# Altium project Mother_board_bna.PrjPcb
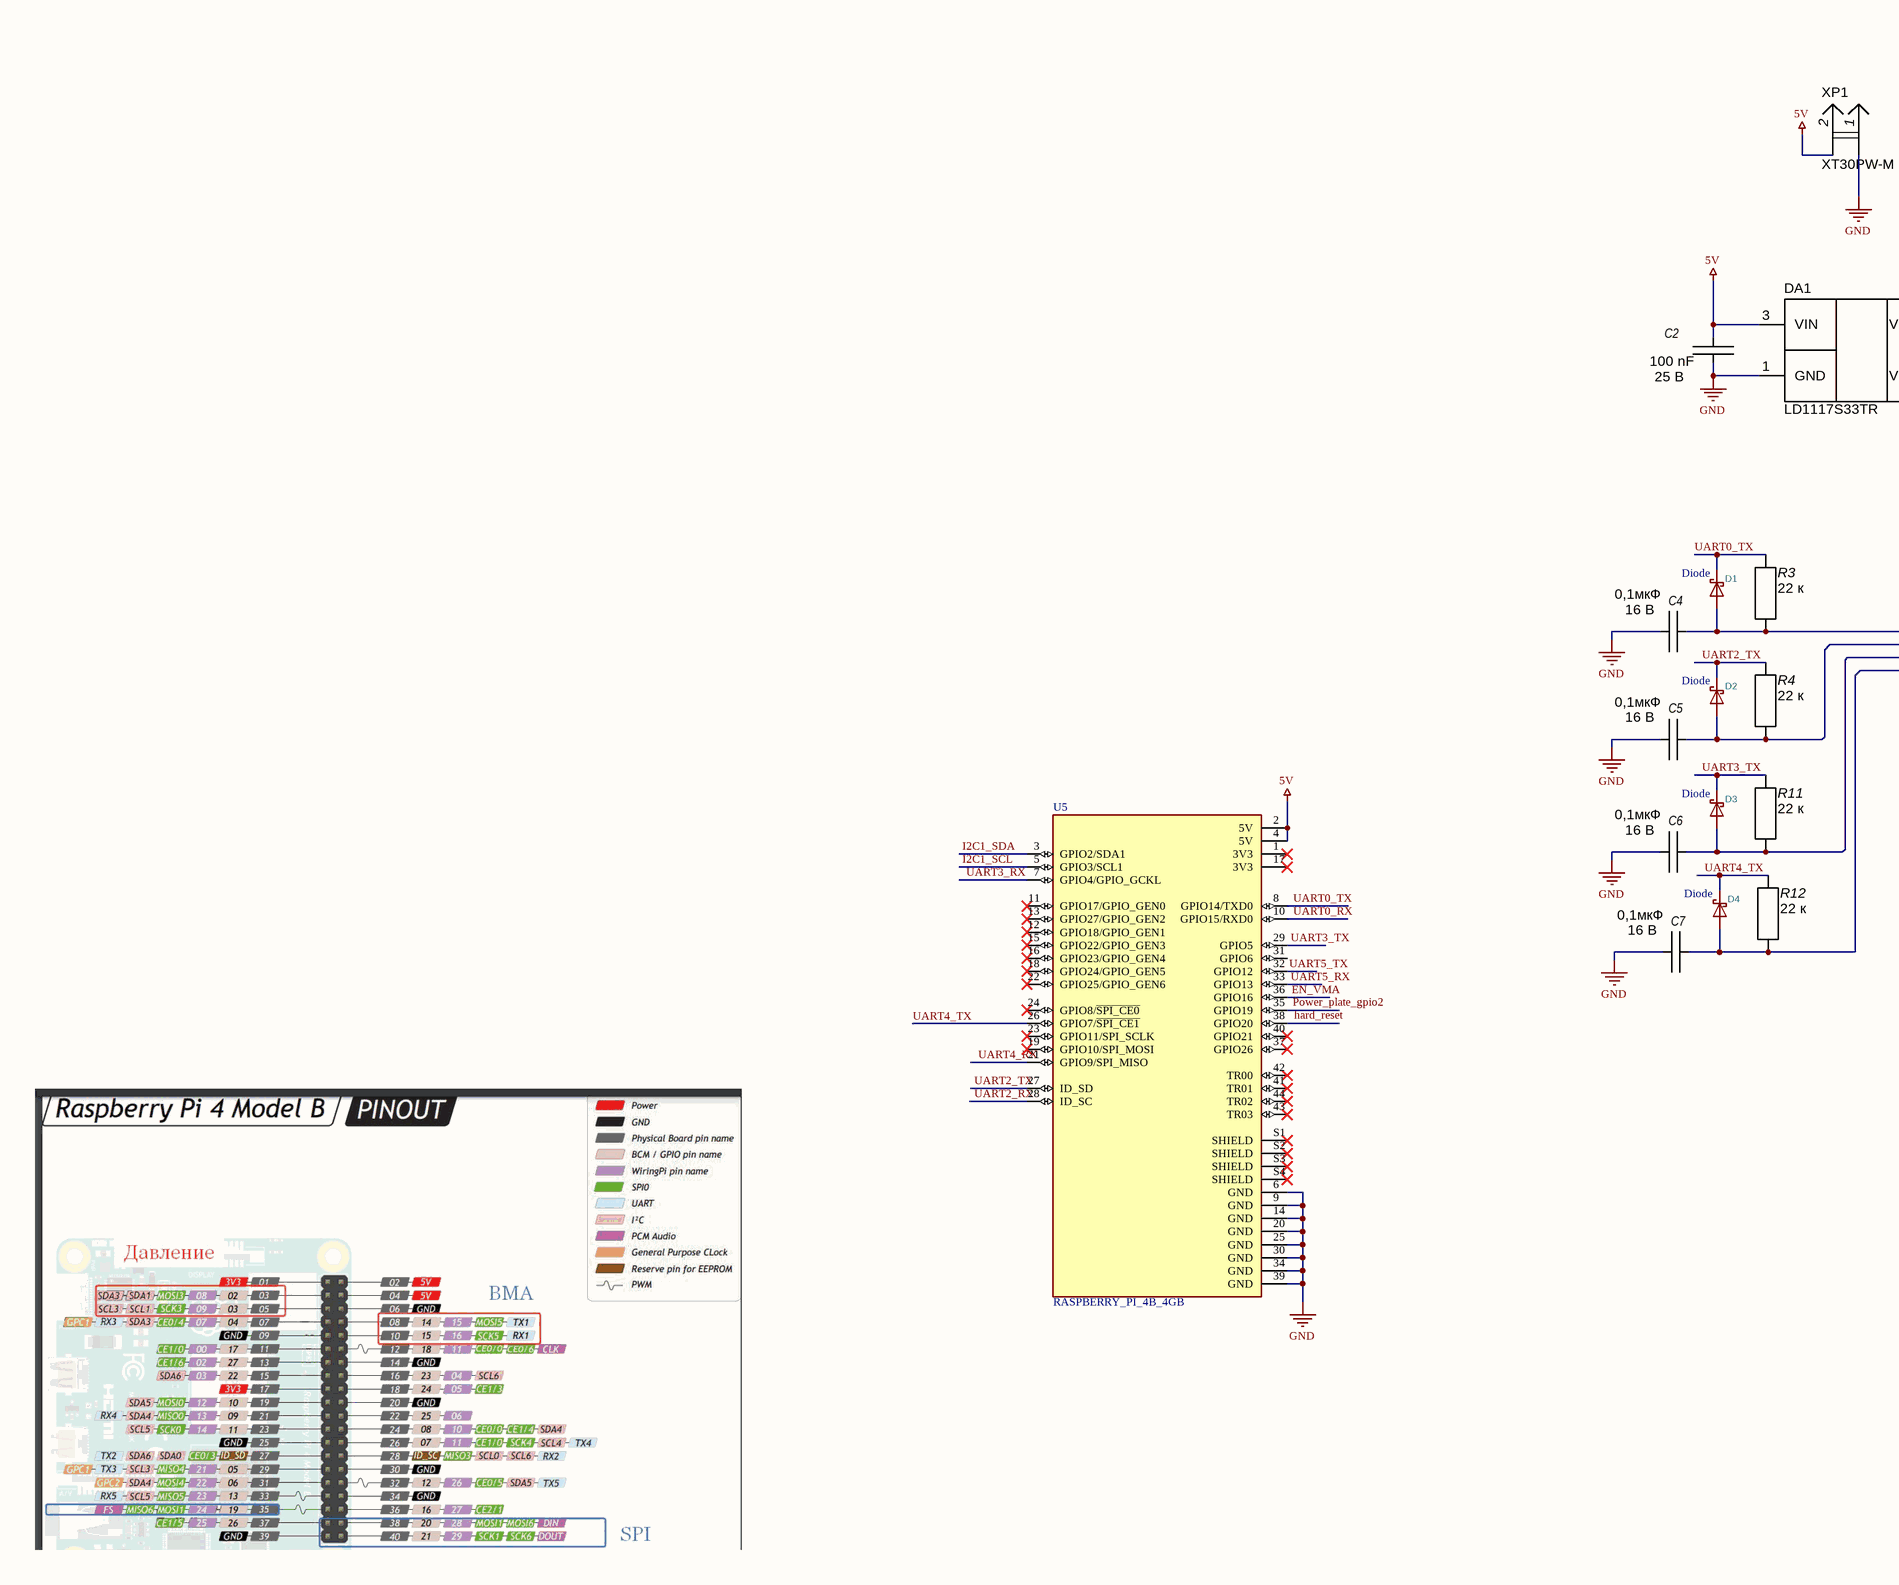
[diagram p0: Main.SchDoc, left]
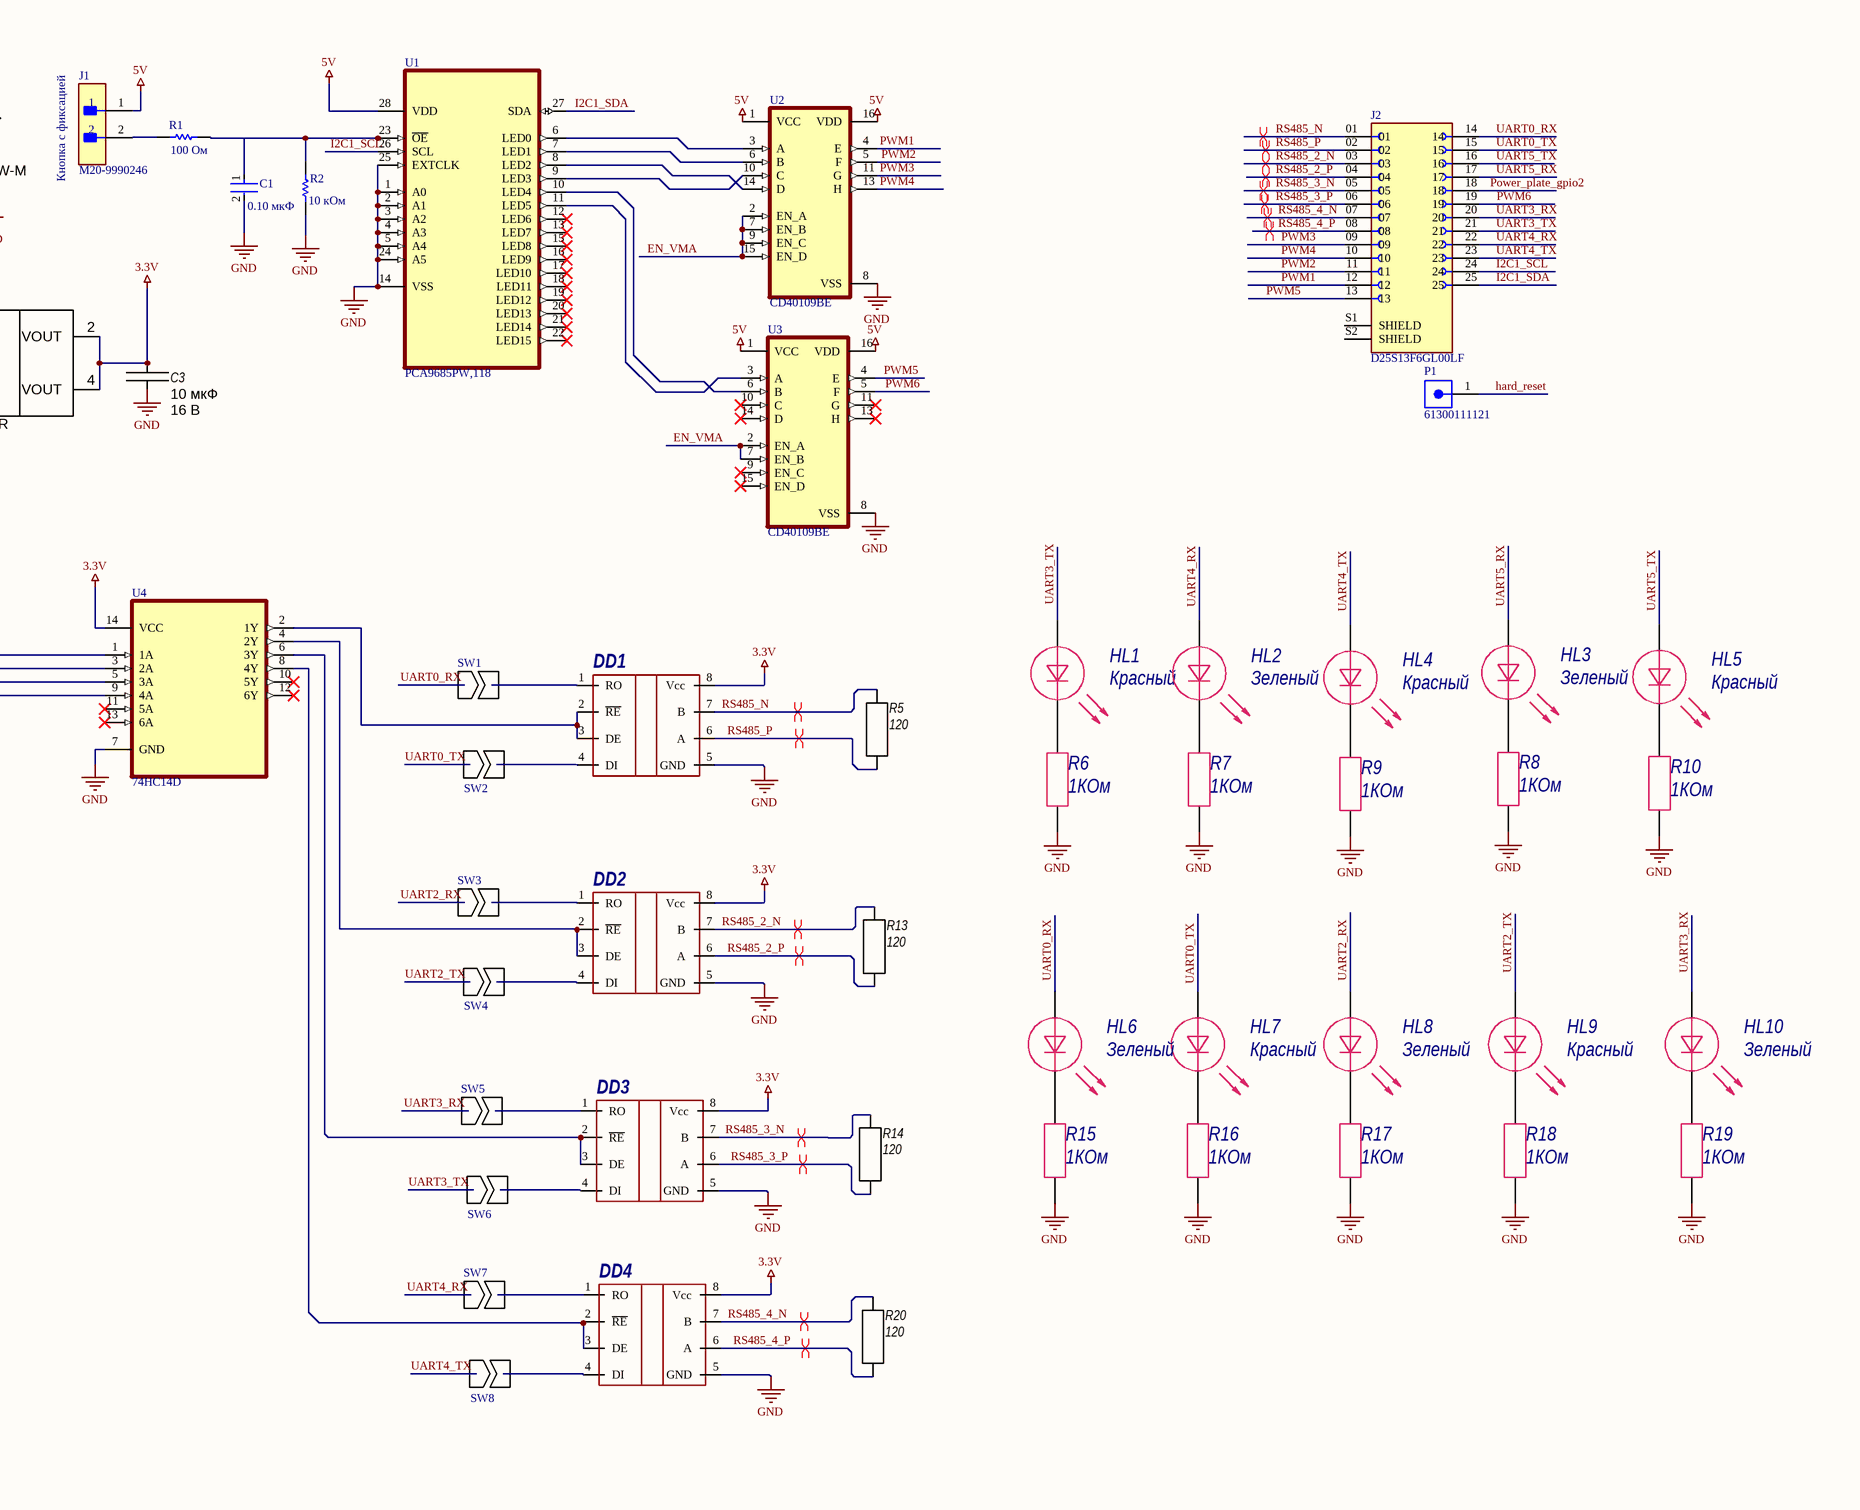
[diagram p1: Main.SchDoc, right]
1 sheet, 63 parts. Net scope: global (net labels, ports and power ports of the same name join across sheets).
Board file: PCB1.PcbDoc

## Sheet Main.SchDoc
size A2; SheetNumber: 2; SheetTotal: 2

### Parts
C1  value 0.10 мкФ  [FP-C0805C-DN-IPC_A]  (hidden comment: C0805C104K5RACTU)
C2  Voltage: 25 В  [C0402C]  (hidden comment: 100 nF)
C3  Voltage: 16 В  [C0805C]  (hidden comment: 10 мкФ)
C4  Voltage: 16 В  [C0603C]  (hidden comment: 0,1мкФ)
C5  Voltage: 16 В  [C0603C]  (hidden comment: 0,1мкФ)
C6  Voltage: 16 В  [C0603C]  (hidden comment: 0,1мкФ)
C7  Voltage: 16 В  [C0603C]  (hidden comment: 0,1мкФ)
D1  Diode  [SOD-123F]
D2  Diode  [SOD-123F]
D3  Diode  [SOD-123F]
D4  Diode  [SOD-123F]
DA1  LD1117S33TR  [SOT-223]
DD1  (no value)  [SOIC8N]
DD2  (no value)  [SOIC8N]
DD3  (no value)  [SOIC8N]
DD4  (no value)  [SOIC8N]
HL1  Color: Красный  [0805D]
HL2  Color: Зеленый  [0805D]
HL3  Color: Зеленый  [0805D]
HL4  Color: Красный  [0805D]
HL5  Color: Красный  [0805D]
HL6  Color: Зеленый  [0805D]
HL7  Color: Красный  [0805D]
HL8  Color: Зеленый  [0805D]
HL9  Color: Красный  [0805D]
HL10  Color: Зеленый  [0805D]
J1  M20-9990246  [FP-M20-9990246-MFG]
J2  D25S13F6GL00LF  [AMPHENOL_D25S13F6GL00LF]
P1  61300111121  [61300111121]
R1  value 100 Ом  [RESC2013X70X40ML20T20]  (hidden comment: ERJ-6ENF1001V)
R2  value 10 кОм  [RESC2013X70X40ML20T20]  (hidden comment: ERJ-6ENF1001V)
R3  22 к  [C0603R]
R4  22 к  [C0603R]
R5  120  [C0603R]
R6  value 1КОм  [0603R]  (hidden comment: Resistor)
R7  value 1КОм  [0603R]  (hidden comment: Resistor)
R8  value 1КОм  [0603R]  (hidden comment: Resistor)
R9  value 1КОм  [0603R]  (hidden comment: Resistor)
R10  value 1КОм  [0603R]  (hidden comment: Resistor)
R11  22 к  [C0603R]
R12  22 к  [C0603R]
R13  120  [C0603R]
R14  120  [C0603R]
R15  value 1КОм  [0603R]  (hidden comment: Resistor)
R16  value 1КОм  [0603R]  (hidden comment: Resistor)
R17  value 1КОм  [0603R]  (hidden comment: Resistor)
R18  value 1КОм  [0603R]  (hidden comment: Resistor)
R19  value 1КОм  [0603R]  (hidden comment: Resistor)
R20  120  [C0603R]
SW1  SW2  [SW2]  (value not drawn)
SW2  SW2  [SW2]  (value not drawn)
SW3  SW2  [SW2]  (value not drawn)
SW4  SW2  [SW2]  (value not drawn)
SW5  SW2  [SW2]  (value not drawn)
SW6  SW2  [SW2]  (value not drawn)
SW7  SW2  [SW2]  (value not drawn)
SW8  SW2  [SW2]  (value not drawn)
U1  PCA9685PW,118  [SOP65P640X110-28N]
U2  CD40109BE  [DIP794W45P254L1969H508Q16]
U3  CD40109BE  [DIP794W45P254L1969H508Q16]
U4  74HC14D  [SOIC127P600X175-14N]
U5  RASPBERRY_PI_4B_4GB  [MODULE_RASPBERRY_PI_4B_4GB]
XP1  XT30PW-M  [XT30PW-M]

### Nets
3.3V: C3.1 DA1.2(VOUT) DA1.4(VOUT) DD1.8(Vcc) DD2.8(Vcc) DD3.8(Vcc) DD4.8(Vcc) U4.14(VCC)
5V: C2.1 DA1.3(VIN) J1.1 U1.28(VDD) U2.1(VCC) U2.16(VDD) U3.1(VCC) U3.16(VDD) U5.2(5V) U5.4(5V) XP1.2
GND: C1.2 C2.2 C3.2 C4.2 C5.2 C6.2 C7.2 DA1.1(GND) DD1.5(GND) DD2.5(GND) DD3.5(GND) DD4.5(GND) R2.1 R6.1 R7.1 R8.1 R9.1 R10.1 R15.1 R16.1 R17.1 R18.1 R19.1 U1.1(A0) U1.2(A1) U1.3(A2) U1.4(A3) U1.5(A4) U1.14(VSS) U1.24(A5) U1.25(EXTCLK) U2.8(VSS) U3.8(VSS) U4.7(GND) U5.6(GND) U5.9(GND) U5.14(GND) U5.20(GND) U5.25(GND) U5.30(GND) U5.34(GND) U5.39(GND) XP1.1
EN_VMA: U2.2(EN_A) U2.7(EN_B) U2.9(EN_C) U2.15(EN_D) U3.2(EN_A) U3.7(EN_B) U5.36(GPIO16)
hard_reset: P1.1 U5.38(GPIO20)
I2C1_SCL: J2.24 U1.26(SCL) U5.5(GPIO3/SCL1)
I2C1_SDA: J2.25 U1.27(SDA) U5.3(GPIO2/SDA1)
Power_plate_gpio2: J2.18 U5.35(GPIO19)
PWM1: J2.12 U2.4(E)
PWM2: J2.11 U2.5(F)
PWM3: J2.09 U2.11(G)
PWM4: J2.10 U2.13(H)
PWM5: J2.13 U3.4(E)
PWM6: J2.19 U3.5(F)
RS485_2_N: DD2.7(B) J2.03 R13.1
RS485_2_P: DD2.6(A) J2.04 R13.2
RS485_3_N: DD3.7(B) J2.05 R14.1
RS485_3_P: DD3.6(A) J2.06 R14.2
RS485_4_N: DD4.7(B) J2.07 R20.1
RS485_4_P: DD4.6(A) J2.08 R20.2
RS485_N: DD1.7(B) J2.01 R5.1
RS485_P: DD1.6(A) J2.02 R5.2
UART0_RX: HL6.1 J2.14 SW1.1 U5.10(GPIO15/RXD0)
UART0_TX: D1.K HL7.1 J2.15 R3.1 SW2.1 U5.8(GPIO14/TXD0)
UART2_RX: HL8.1 SW3.1 U5.28(ID_SC)
UART2_TX: D2.K HL9.1 R4.1 SW4.1 U5.27(ID_SD)
UART3_RX: HL10.1 J2.20 SW5.1 U5.7(GPIO4/GPIO_GCKL)
UART3_TX: D3.K HL1.1 J2.21 R11.1 SW6.1 U5.29(GPIO5)
UART4_RX: HL2.1 J2.22 SW7.1 U5.21(GPIO9/SPI_MISO)
UART4_TX: D4.K HL4.1 J2.23 R12.1 SW8.1 U5.26(GPIO7/~{SPI_CE1})
UART5_RX: HL3.1 J2.17 U5.33(GPIO13)
UART5_TX: HL5.1 J2.16 U5.32(GPIO12)
NetC1_1: C1.1 R1.2 R2.2 U1.23(~{OE})
NetC4_1: C4.1 D1.A R3.2 U4.1(1A)
NetC5_1: C5.1 D2.A R4.2 U4.3(2A)
NetC6_1: C6.1 D3.A R11.2 U4.5(3A)
NetC7_1: C7.1 D4.A R12.2 U4.9(4A)
NetDD1_1: DD1.1(RO) SW1.2
NetDD1_2: DD1.2(~{RE}) DD1.3(DE) U4.2(1Y)
NetDD1_4: DD1.4(DI) SW2.2
NetDD2_1: DD2.1(RO) SW3.2
NetDD2_2: DD2.2(~{RE}) DD2.3(DE) U4.4(2Y)
NetDD2_4: DD2.4(DI) SW4.2
NetDD3_1: DD3.1(RO) SW5.2
NetDD3_2: DD3.2(~{RE}) DD3.3(DE) U4.6(3Y)
NetDD3_4: DD3.4(DI) SW6.2
NetDD4_1: DD4.1(RO) SW7.2
NetDD4_2: DD4.2(~{RE}) DD4.3(DE) U4.8(4Y)
NetDD4_4: DD4.4(DI) SW8.2
NetHL1_2: HL1.2 R6.2
NetHL2_2: HL2.2 R7.2
NetHL3_2: HL3.2 R8.2
NetHL4_2: HL4.2 R9.2
NetHL5_2: HL5.2 R10.2
NetHL6_2: HL6.2 R15.2
NetHL7_2: HL7.2 R16.2
NetHL8_2: HL8.2 R17.2
NetHL9_2: HL9.2 R18.2
NetHL10_2: HL10.2 R19.2
NetJ1_2: J1.2 R1.1
NetU1_6: U1.6(LED0) U2.3(A)
NetU1_7: U1.7(LED1) U2.6(B)
NetU1_8: U1.8(LED2) U2.14(D)
NetU1_9: U1.9(LED3) U2.10(C)
NetU1_10: U1.10(LED4) U3.6(B)
NetU1_11: U1.11(LED5) U3.3(A)

Not connected (* = marked no-connect by the designer): J2 S1(SHIELD) S2(SHIELD); U1 12(LED6)* 13(LED7)* 15(LED8)* 16(LED9)* 17(LED10)* 18(LED11)* 19(LED12)* 20(LED13)* 21(LED14)* 22(LED15)*; U3 9(EN_C)* 10(C)* 11(G)* 13(H)* 14(D)* 15(EN_D)*; U4 10(5Y)* 11(5A)* 12(6Y)* 13(6A)*; U5 1(3V3)* 11(GPIO17/GPIO_GEN0)* 12(GPIO18/GPIO_GEN1)* 13(GPIO27/GPIO_GEN2)* 15(GPIO22/GPIO_GEN3)* 16(GPIO23/GPIO_GEN4)* 17(3V3)* 18(GPIO24/GPIO_GEN5)* 19(GPIO10/SPI_MOSI)* 22(GPIO25/GPIO_GEN6)* 23(GPIO11/SPI_SCLK)* 24(GPIO8/~{SPI_CE0})* 31(GPIO6) 37(GPIO26)* 40(GPIO21)* 41(TR01)* 42(TR00)* 43(TR03)* 44(TR02)* S1(SHIELD)* S2(SHIELD)* S3(SHIELD)* S4(SHIELD)*

### Layout directives
differential pair: RS485_2_N, RS485_2_P, RS485_3_N, RS485_3_P, RS485_4_N, RS485_4_P, RS485_N, RS485_P

### Notes on the sheet
- (near J1) Кнопка с фиксацией

### Library data of the parts
C1 = CMP-2007-00279-2: CAP CER 0.1UF 50V X7R 0805; Manufacturer: KEMET; Tolerance: 0.1; Temperature Coefficient: 30ppm/°C; Material: Ceramic; Capacitance: 0.10 μF; Manufacturer Part Number: C0805C104K5RACTU; Device Class L2: Capacitors; Temperature Range Low: -55°C; Voltage Rating: 50 V; Digikey Description: CAP CER 0.1UF 50V X7R 0805; Category: Cap; ComponentLink2Description: Datasheet; Octopart: https://octopart.com/c0805c104k5ractu-kemet-143926; RoHS: TRUE; ComponentLink2URL: https://content.kemet.com/datasheets/KEM_C1003_C0G_SMD.pdf; Temperature Characteristic: X7R; Temperature: -55°C to +125°C; Height: 0.88mm; Temperature Range High: +125°C; Device Class L1: Passive Components; Automotive: No; Lead Free: Yes; Ipc Land Pattern Name: CAPC200125X78; Device Class L3: Ceramic Capacitors; Mouser Description: Cap Ceramic 0.1uF 50V X7R 10% SMD 2.0 x 1.2 mm 125 C Paper T/R; Package: C0805C-DN
C2 = CL05B103KA5NNNC: SMD 0402 ; X7R; 0,01 мкФ; 25 В; Manufacturer: SAMSUNG; Persent: ±10%; Type: Ceramic; Part Number: CL05B103KA5NNNC; Package: SMD 0402; Dielectric: X7R; ComponentLink1Description: Datasheet; Value: 100 nF
C3 = CL21B106KOQNNNE: SMD 0805; X7R; 10 мкФ; 16 В; Manufacturer: SAMSUNG; Persent: ±15%; Type: Ceramic; Part Number: CL21B106KOQNNNE; Package: SMD 0805; Dielectric: X7R; ComponentLink1Description: Datasheet; Value: 10 мкФ
C4-C7 = CL10B152KB8NNNC: SMD 0603 ; X7R; 1,5 нФ; 50 В; Manufacturer: SAMSUNG; Persent: ±15%; Type: Ceramic; Part Number: CL10B152KB8NNNC; Package: SMD 0603; Dielectric: X7R; ComponentLink1Description: Datasheet; Value: 0,1мкФ
D1-D4 = Schottky-Diode: ki_description: Schottky Diode; Datasheet: https://diotec.com/de/produktliste/SBD.html; ki_keywords: Schottky
DA1 = LD1117S33TR: Linear regulator, 3V3; Manufacturer: STMicroelectronics; Type: Linear regulator; Part Number: LD1117S33TR
DD1-DD4 = MAX3072E: Half-duplex; Manufacturer: MAXIM; Rate: 3.3v; Notice: True fail-safe; Datasheet: https://static.chipdip.ru/lib/276/DOC000276899.pdf; Shop: https://www.chipdip.ru/product/max3072eesa; Case: soic-8(0.154 inch)
HL1-HL10 = LED: Manufacturer: -; Rate: -; Datasheet: -; Shop: -; Notice: -; Case: -
J1 = CMP-15831-000009-1: CONN HEADER VERT 2POS 2.54MM; Manufacturer: Harwin; Conn Gender: Male; Conn Orientation: Vertical; Number Of Contacts: 2; Current Rating: 3A; ComponentLink2URL: https://cdn.harwin.com/pdfs/M20-999.pdf; ComponentLink2Description: Datasheet; Package: M20-9990246; Temperature: -40°C to +105°C; Octopart: https://octopart.com/m20-9990246-harwin-2590635; Mouser Description: 2.54mm (0.1") Pitch SIL Vertical PC Tail Pin Header, 6.1mm mating pin height, tin, 2 contacts; Temperature Range High: +105°C; Device Class L1: Connectors; RoHS: TRUE; Automotive: No; Height: 8.99mm; Number Of Rows: 1; Contact Material: Tin,Nickel; Category: Conn; Pitch: 2.54mm; Lead Free: Yes; Digikey Description: CONN HEADER VERT 2POS 2.54MM; Manufacturer Part Number: M20-9990246; Temperature Range Low: -40°C; Device Class L3: unset; Device Class L2: Headers and Wire Housings
J2 = D25S13F6GL00LF: DSUB RASOLDER25SOCKET LF; MF: Amphenol ICC (FCI); MP: D25S13F6GL00LF; Price: None; Availability: In Stock; Package: None; SnapEDA_Link: https://www.snapeda.com/parts/D25S13F6GL00LF/Amphenol+FCI/view-part/?ref=snap; Purchase-URL: https://pricing.snapeda.com/search/part/D25S13F6GL00LF/?ref=eda; Value: *; Check_prices: https://www.snapeda.com/parts/D25S13F6GL00LF/Amphenol+FCI/view-part/?ref=eda
P1 = CMP-1502-01058-3: NexarPartId: 32855518; Current Rating: 3A; Connector Type: Male Pin; Number of Positions: 1; Contact Resistance: 20mΩ; Gender: Male; Operating Supply Voltage: 250V; Orientation: Vertical; Contact Mating Length: 5.9944mm; Termination: Solder; Number of Rows: 1; Number of Pins: 1; Mount: Through Hole; RoHS: Compliant; Contact Material: Copper; Color: Black; Lead Pitch: 2.54mm; Number of Contacts: 1; Contact Plating: Gold; Packaging: Bulk; REACH SVHC: Unknown
R1 R2 = CMP-2001-04375-5: Chip Resistor, 100 Ohm, +/- 1%, 0.125 W, -55 to 155 degC, 0805 (2012 Metric), RoHS, Tape and Reel; Manufacturer: Panasonic; ComponentLink1URL: http://www.panasonic.com/; ComponentLink2Description: Datasheet; REACH SVHC: Yes; ComponentLink1Description: Manufacturer URL; Length: 2 mm; Height: 0.6 mm; Package Quantity: 1; PackageDescription: 2-Pin Surface Mount Device, Body 2 x 1.25 mm; Packaging: Cut Tape; PackageReference: 0805; Max Operating Temperature: 155 degC; Mounting Technology: Surface Mount; ComponentLink2URL: http://industrial.panasonic.com/cdbs/www-data/pdf/RDA0000/AOA0000C86.pdf; DatasheetVersion: 04/2015; Min Operating Temperature: -55 degC; RoHSCompliant: true; Mount: Surface Mount
R3 R4 R11 R12 = RC0603FR-0722KL: SMD 0603; 0,1; 1%; 22 кОм; Manufacturer: Yageo; Power: 0,1; TCR: 200 ppm; Part Number: RC0603FR-0722KL; Package: SMD 0603; Persent: 1%; Category: R; Value: 22 к
R5 R13 R14 R20 = RC0603FR-07120RL: SMD 0603; 0,1; 1%; 120 Ом; Manufacturer: Yageo; Power: 0,1; TCR: 200 ppm; Part Number: RC0603FR-07120RL; Package: SMD 0603; Persent: 1%; Value: 120; Category: R
U1 = PCA9685PW,118: LED Driver IC 16 Output Linear - PWM Dimming 25mA 28-TSSOP; MF: NXP USA; Value: *; MP: PCA9685PW,118; Purchase-URL: https://pricing.snapeda.com/search/part/PCA9685PW,118/?ref=eda; Availability: In Stock; Price: None; Package: TSSOP-28 NXP Semiconductors
U2 U3 = CD40109BE: Ð§ÐµÑ‚Ñ‹Ñ€ÐµÑ…ÑŠÑÐ´ÐµÑ€Ð½Ñ‹Ð¹ ÐšÐœÐžÐŸ-Ð¿Ñ€ÐµÐ¾Ð±Ñ€Ð°Ð·Ð¾Ð²Ð°Ñ‚ÐµÐ»ÑŒ Ð½Ð¸Ð·ÐºÐ¾Ð³Ð¾ Ð½Ð°Ð¿Ñ€ÑÐ¶ÐµÐ½Ð¸Ñ Ð² Ð²Ñ‹ÑÐ¾ÐºÐ¾Ðµ (Ð½Ð¾Ð¼Ð¸Ð½Ð°Ð»ÑŒÐ½Ð¾Ðµ Ð½Ð°Ð¿Ñ€ÑÐ¶ÐµÐ½Ð¸Ðµ 20 Ð’); MF: Texas Instruments; SnapEDA_Link: https://www.snapeda.com/parts/CD40109BE/Texas+Instruments/view-part/?ref=snap; Package: PDIP-16 Texas Instruments; Value: *; MP: CD40109BE; Check_prices: https://www.snapeda.com/parts/CD40109BE/Texas+Instruments/view-part/?ref=eda
U4 = 74HC14D: Inverter IC 6 Channel Schmitt Trigger 14-SOIC; MF: Toshiba; SnapEDA_Link: https://www.snapeda.com/parts/74HC14D/Toshiba+Semiconductor+and+Storage/view-part/?ref=snap; Availability: In Stock; Price: None; Package: SO14-14 Nexperia USA Inc.; Purchase-URL: https://pricing.snapeda.com/search/part/74HC14D/?ref=eda; Check_prices: https://www.snapeda.com/parts/74HC14D/Toshiba+Semiconductor+and+Storage/view-part/?ref=eda; Value: *; MP: 74HC14D
U5 = RASPBERRY_PI_4B_4GB: BCM2711 Raspberry Pi 4 Model B 4GB - ARMÂ® CortexÂ®-A72 MPU Embedded Evaluation Board; MP: RASPBERRY PI 4B/4GB; Price: None; MF: Raspberry Pi; Check_prices: https://www.snapeda.com/parts/RASPBERRY%20PI%204B/4GB/Raspberry+Pi/view-part/?ref=eda; Value: *; Purchase-URL: https://pricing.snapeda.com/search/part/RASPBERRY PI 4B/4GB/?ref=eda; Availability: In Stock; SnapEDA_Link: https://www.snapeda.com/parts/RASPBERRY%20PI%204B/4GB/Raspberry+Pi/view-part/?ref=snap; Package: None
XP1 = XT30PW-M: Manufacturer: AMASS; Type: XT; Part Number: XT30PW-M